# EAGLE schematic Dummy (EAGLE 9.6.2)
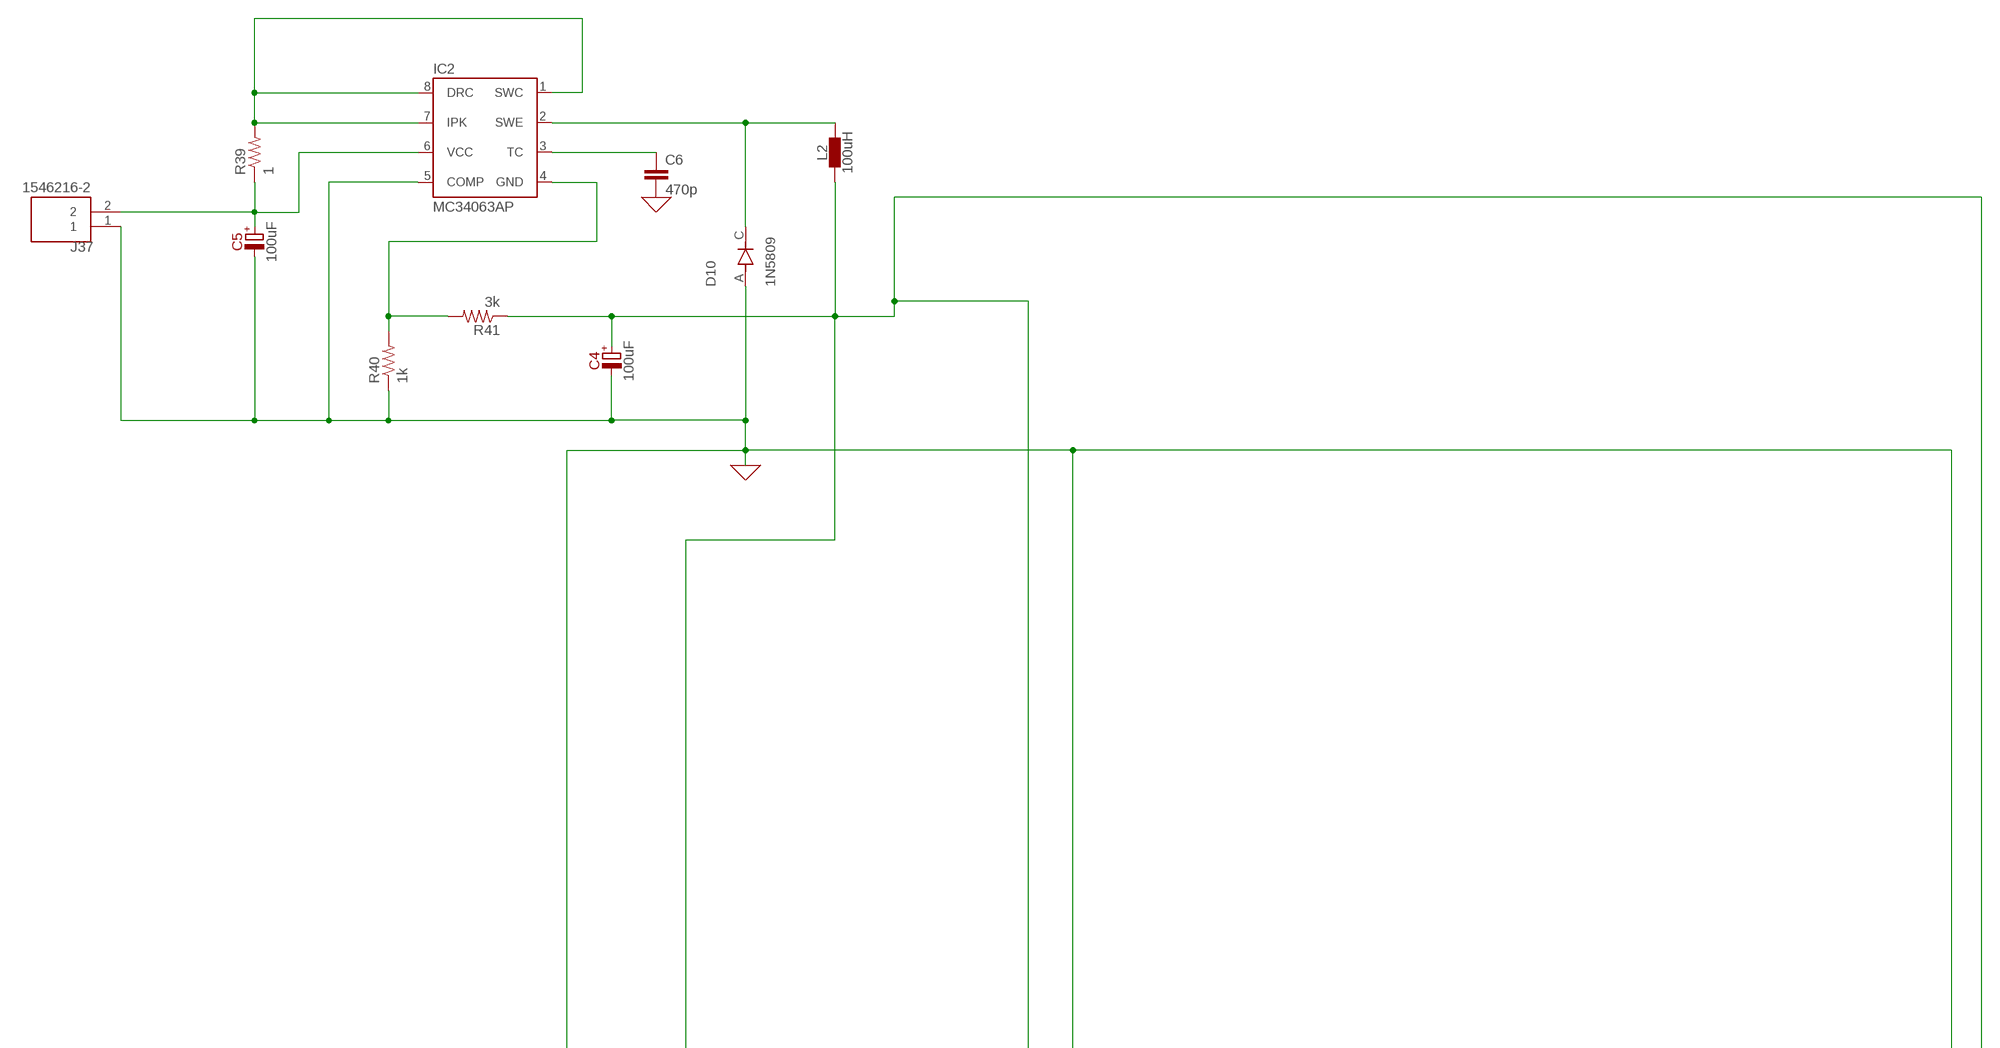
[diagram p0: schematic, sheet 1, part 1 of 3]
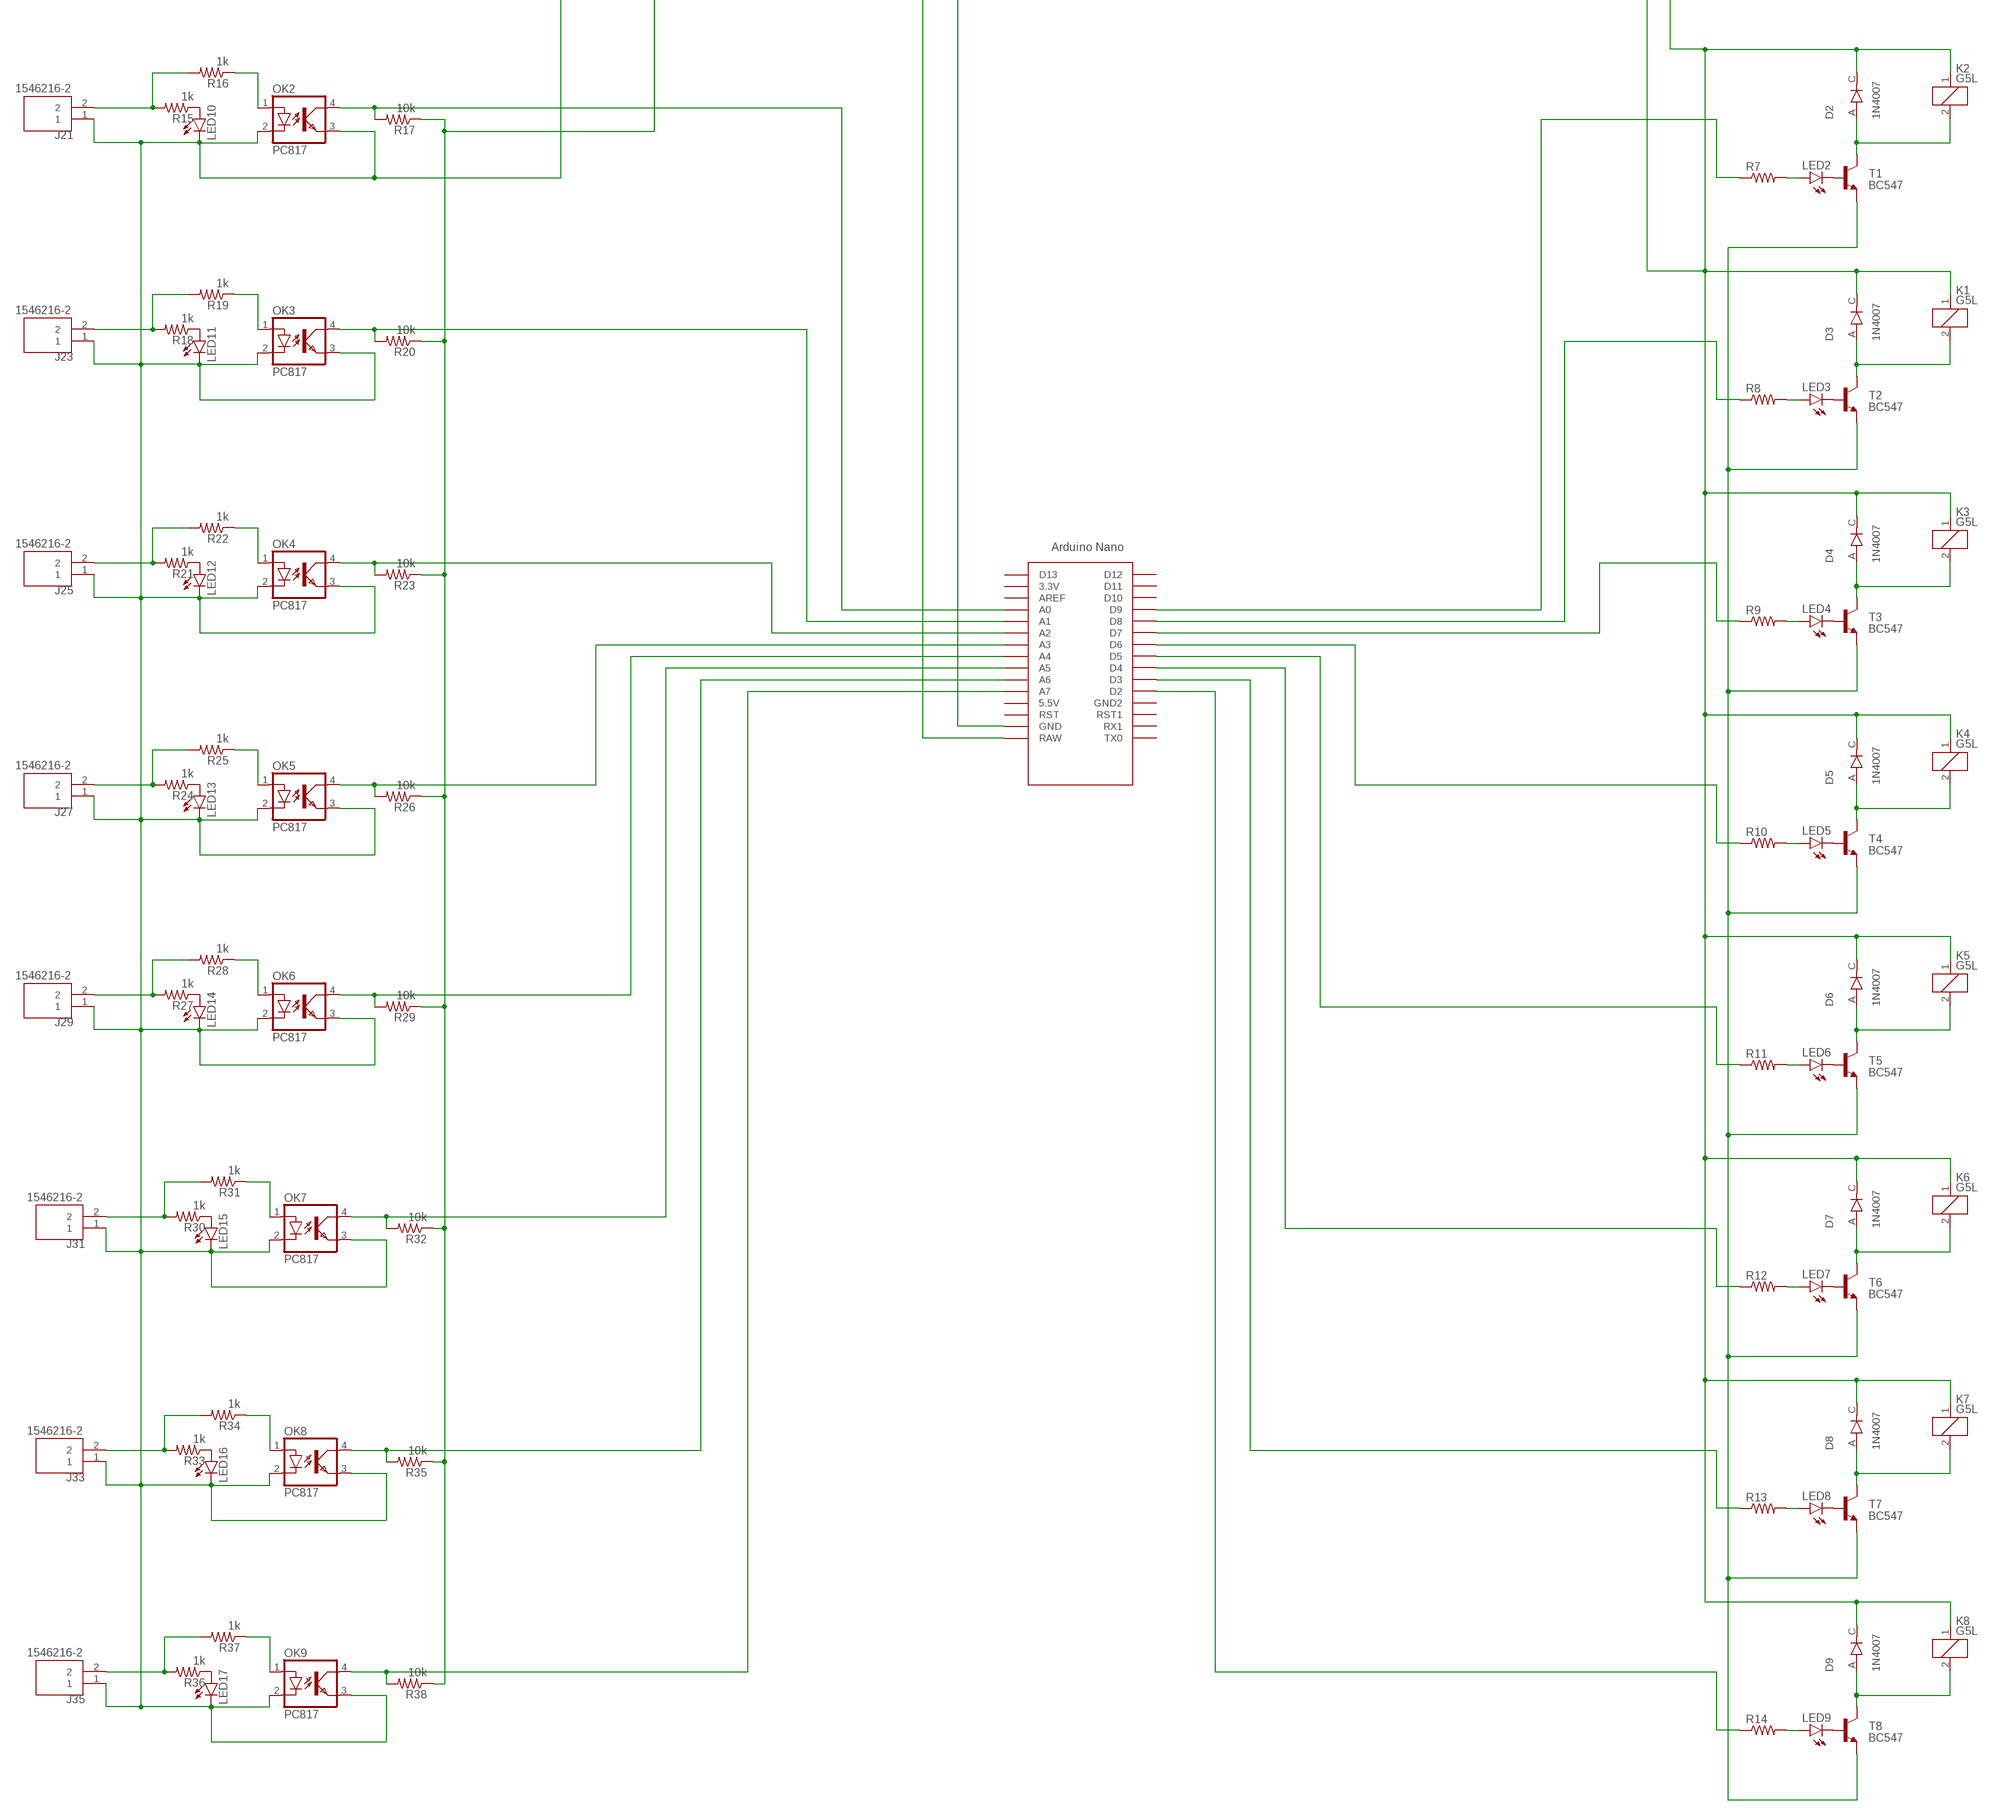
[diagram p1: schematic, sheet 1, part 2 of 3]
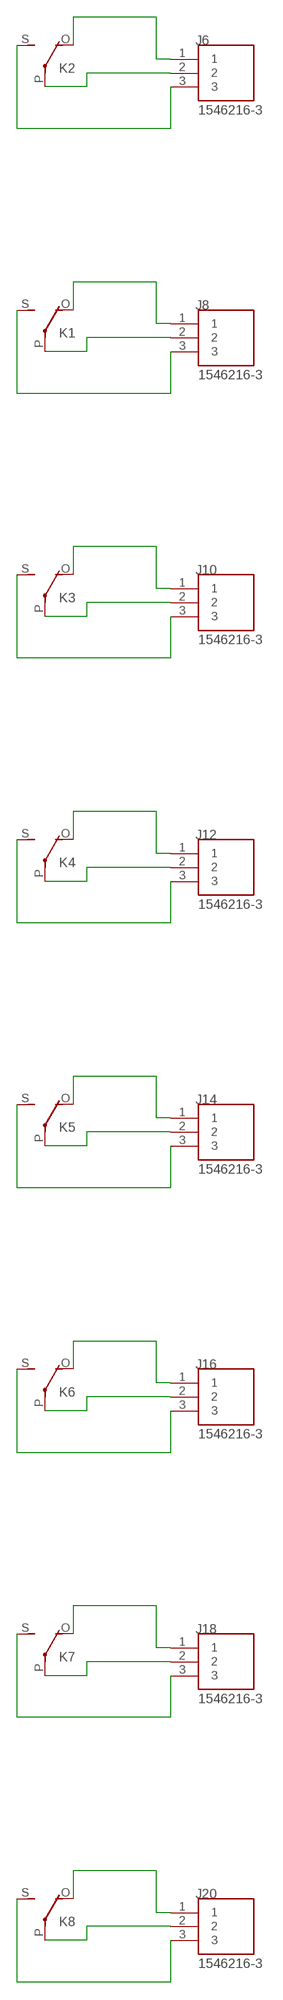
[diagram p2: schematic, sheet 1, part 3 of 3]

## Parts
C4  100uF  1U/50V  [E1,5-4]
C5  100uF  1U/50V  [E1,5-4]
C6  470p  C2.5/2  [C2.5-2]
D2  1N4007  [DIOAD1060W80L520D270]
D3  1N4007  [DIOAD1060W80L520D270]
D4  1N4007  [DIOAD1060W80L520D270]
D5  1N4007  [DIOAD1060W80L520D270]
D6  1N4007  [DIOAD1060W80L520D270]
D7  1N4007  [DIOAD1060W80L520D270]
D8  1N4007  [DIOAD1060W80L520D270]
D9  1N4007  [DIOAD1060W80L520D270]
D10  1N5809  1N4007  [DIOAD1060W80L520D270]
IC2  MC34063AP  [DIL-08]
J6  1546216-3  [TE_1546216-3]
J8  1546216-3  [TE_1546216-3]
J10  1546216-3  [TE_1546216-3]
J12  1546216-3  [TE_1546216-3]
J14  1546216-3  [TE_1546216-3]
J16  1546216-3  [TE_1546216-3]
J18  1546216-3  [TE_1546216-3]
J20  1546216-3  [TE_1546216-3]
J21  1546216-2  [TE_1546216-2]
J23  1546216-2  [TE_1546216-2]
J25  1546216-2  [TE_1546216-2]
J27  1546216-2  [TE_1546216-2]
J29  1546216-2  [TE_1546216-2]
J31  1546216-2  [TE_1546216-2]
J33  1546216-2  [TE_1546216-2]
J35  1546216-2  [TE_1546216-2]
J37  1546216-2  [TE_1546216-2]
K1  G5L  [G5LE]
K2  G5L  [G5LE]
K3  G5L  [G5LE]
K4  G5L  [G5LE]
K5  G5L  [G5LE]
K6  G5L  [G5LE]
K7  G5L  [G5LE]
K8  G5L  [G5LE]
L2  100uH  INDUCTOR-NR80XX  [L_NR80XX]
LED2  LED3MM  [LED3MM]
LED3  LED3MM  [LED3MM]
LED4  LED3MM  [LED3MM]
LED5  LED3MM  [LED3MM]
LED6  LED3MM  [LED3MM]
LED7  LED3MM  [LED3MM]
LED8  LED3MM  [LED3MM]
LED9  LED3MM  [LED3MM]
LED10  LED3MM  [LED3MM]
LED11  LED3MM  [LED3MM]
LED12  LED3MM  [LED3MM]
LED13  LED3MM  [LED3MM]
LED14  LED3MM  [LED3MM]
LED15  LED3MM  [LED3MM]
LED16  LED3MM  [LED3MM]
LED17  LED3MM  [LED3MM]
OK2  PC817  [DIL04]
OK3  PC817  [DIL04]
OK4  PC817  [DIL04]
OK5  PC817  [DIL04]
OK6  PC817  [DIL04]
OK7  PC817  [DIL04]
OK8  PC817  [DIL04]
OK9  PC817  [DIL04]
R7  R-US_0207/15  [0207/15]
R8  R-US_0207/15  [0207/15]
R9  R-US_0207/15  [0207/15]
R10  R-US_0207/15  [0207/15]
R11  R-US_0207/15  [0207/15]
R12  R-US_0207/15  [0207/15]
R13  R-US_0207/15  [0207/15]
R14  R-US_0207/15  [0207/15]
R15  1k  R-US_0207/15  [0207/15]
R16  1k  R-US_0207/15  [0207/15]
R17  10k  R-US_0207/15  [0207/15]
R18  1k  R-US_0207/15  [0207/15]
R19  1k  R-US_0207/15  [0207/15]
R20  10k  R-US_0207/15  [0207/15]
R21  1k  R-US_0207/15  [0207/15]
R22  1k  R-US_0207/15  [0207/15]
R23  10k  R-US_0207/15  [0207/15]
R24  1k  R-US_0207/15  [0207/15]
R25  1k  R-US_0207/15  [0207/15]
R26  10k  R-US_0207/15  [0207/15]
R27  1k  R-US_0207/15  [0207/15]
R28  1k  R-US_0207/15  [0207/15]
R29  10k  R-US_0207/15  [0207/15]
R30  1k  R-US_0207/15  [0207/15]
R31  1k  R-US_0207/15  [0207/15]
R32  10k  R-US_0207/15  [0207/15]
R33  1k  R-US_0207/15  [0207/15]
R34  1k  R-US_0207/15  [0207/15]
R35  10k  R-US_0207/15  [0207/15]
R36  1k  R-US_0207/15  [0207/15]
R37  1k  R-US_0207/15  [0207/15]
R38  10k  R-US_0207/15  [0207/15]
R39  1  R-US_0207/12  [0207/12]
R40  1k  R-US_0207/12  [0207/12]
R41  3k  R-US_0207/12  [0207/12]
T1  BC547  [TO92]
T2  BC547  [TO92]
T3  BC547  [TO92]
T4  BC547  [TO92]
T5  BC547  [TO92]
T6  BC547  [TO92]
T7  BC547  [TO92]
T8  BC547  [TO92]
U$1  NANO  [NANO]

## Nets
0: C4.+ C4.- C5.- C6.2 D2.C D3.C D4.C D5.C D6.C D7.C D8.C D9.C D10.A IC2.5(COMP) J21.1 J23.1 J25.1 J27.1 J29.1 J31.1 J33.1 J35.1 J37.1 K1.1 K2.1 K3.1 K4.1 K5.1 K6.1 K7.1 K8.1 L2.1 LED10.K(C) LED11.K(C) LED12.K(C) LED13.K(C) LED14.K(C) LED15.K(C) LED16.K(C) LED17.K(C) OK2.2(C) OK2.3(EMIT) OK3.2(C) OK3.3(EMIT) OK4.2(C) OK4.3(EMIT) OK5.2(C) OK5.3(EMIT) OK6.2(C) OK6.3(EMIT) OK7.2(C) OK7.3(EMIT) OK8.2(C) OK8.3(EMIT) OK9.2(C) OK9.3(EMIT) R17.1 R20.1 R23.1 R26.1 R29.1 R32.1 R35.1 R38.1 R40.1 R41.1 U$1.GND U$1.RAW ; supply symbol labelled GND
N$13: LED2.K(C) T1.2(B)
N$14: R7.1 U$1.D9
N$15: LED2.A R7.2
N$16: D2.A K2.2 T1.3(C)
N$19: J6.1 K2.O(2:O)
N$20: J6.2 K2.P(2:P)
N$21: J6.3 K2.S(2:S)
N$22: LED3.K(C) T2.2(B)
N$23: R8.1 U$1.D8
N$24: LED3.A R8.2
N$25: D3.A K1.2 T2.3(C)
N$28: J8.1 K1.O(2:O)
N$29: J8.2 K1.P(2:P)
N$30: J8.3 K1.S(2:S)
N$31: LED4.K(C) T3.2(B)
N$32: R9.1 U$1.D7
N$33: LED4.A R9.2
N$34: D4.A K3.2 T3.3(C)
N$37: J10.1 K3.O(2:O)
N$38: J10.2 K3.P(2:P)
N$39: J10.3 K3.S(2:S)
N$40: LED5.K(C) T4.2(B)
N$41: R10.1 U$1.D6
N$42: LED5.A R10.2
N$43: D5.A K4.2 T4.3(C)
N$46: J12.1 K4.O(2:O)
N$47: J12.2 K4.P(2:P)
N$48: J12.3 K4.S(2:S)
N$49: LED6.K(C) T5.2(B)
N$50: R11.1 U$1.D5
N$51: LED6.A R11.2
N$52: D6.A K5.2 T5.3(C)
N$55: J14.1 K5.O(2:O)
N$56: J14.2 K5.P(2:P)
N$57: J14.3 K5.S(2:S)
N$58: LED7.K(C) T6.2(B)
N$59: R12.1 U$1.D4
N$60: LED7.A R12.2
N$61: D7.A K6.2 T6.3(C)
N$64: J16.1 K6.O(2:O)
N$65: J16.2 K6.P(2:P)
N$66: J16.3 K6.S(2:S)
N$67: LED8.K(C) T7.2(B)
N$68: R13.1 U$1.D3
N$69: LED8.A R13.2
N$70: D8.A K7.2 T7.3(C)
N$73: J18.1 K7.O(2:O)
N$74: J18.2 K7.P(2:P)
N$75: J18.3 K7.S(2:S)
N$76: LED9.K(C) T8.2(B)
N$77: R14.1 U$1.D2
N$78: LED9.A R14.2
N$79: D9.A K8.2 T8.3(C)
N$80: T1.1(E) T2.1(E) T3.1(E) T4.1(E) T5.1(E) T6.1(E) T7.1(E) T8.1(E)
N$82: J20.1 K8.O(2:O)
N$83: J20.2 K8.P(2:P)
N$84: J20.3 K8.S(2:S)
N$85: LED10.A R15.1
N$86: J21.2 R15.2 R16.2
N$87: OK2.1(A) R16.1
N$90: OK2.4(COL) R17.2 U$1.A0
N$91: LED11.A R18.1
N$92: J23.2 R18.2 R19.2
N$93: OK3.1(A) R19.1
N$96: OK3.4(COL) R20.2 U$1.A1
N$97: LED12.A R21.1
N$98: J25.2 R21.2 R22.2
N$99: OK4.1(A) R22.1
N$102: OK4.4(COL) R23.2 U$1.A2
N$103: LED13.A R24.1
N$104: J27.2 R24.2 R25.2
N$105: OK5.1(A) R25.1
N$108: OK5.4(COL) R26.2 U$1.A3
N$109: LED14.A R27.1
N$110: J29.2 R27.2 R28.2
N$111: OK6.1(A) R28.1
N$114: OK6.4(COL) R29.2 U$1.A4
N$115: LED15.A R30.1
N$116: J31.2 R30.2 R31.2
N$117: OK7.1(A) R31.1
N$120: OK7.4(COL) R32.2 U$1.A5
N$121: LED16.A R33.1
N$122: J33.2 R33.2 R34.2
N$123: OK8.1(A) R34.1
N$126: OK8.4(COL) R35.2 U$1.A6
N$127: LED17.A R36.1
N$128: J35.2 R36.2 R37.2
N$129: OK9.1(A) R37.1
N$132: OK9.4(COL) R38.2 U$1.A7
N$133: IC2.1(SWC) IC2.7(IPK) IC2.8(DRC) R39.2
N$134: D10.C IC2.2(SWE) L2.2
N$135: C6.1 IC2.3(TC)
N$136: IC2.4(GND) R40.2 R41.2
N$138: C5.+ IC2.6(VCC) J37.2 R39.1
Unconnected: U$1.3.3V U$1.5V(5.5V) U$1.AREF U$1.D10 U$1.D11 U$1.D12 U$1.D13 U$1.GND1(GND2) U$1.ICSP1 U$1.ICSP2 U$1.ICSP3 U$1.ICSP4 U$1.ICSP5 U$1.ICSP6 U$1.RST U$1.RST1 U$1.RX1 U$1.TX0

## Library data of the parts
C4 C5 = capacitors-electrolytic:?; MOUSER: 647-USW1H010MDD
C6 = capacitor-wima:C: CAPACITOR naming: grid - package width
D2-D10 = 1N4007:1N4007: Diode Switching 1KV 1A 2-Pin DO-41 Check availability <https://pricing.snapeda.com/parts/1N4007/ON%20Semiconductor/view-part?ref=eda>; AVAILABILITY: In Stock; DESCRIPTION: Diode Standard 1000V 1A Through Hole DO-204AL (DO-41); MF: ON Semiconductor; MP: 1N4007; PACKAGE: DO-41-2 ON Semiconductor; PRICE: None; PURCHASE-URL: https://pricing.snapeda.com/search/part/1N4007/?ref=eda
IC2 = MC34063A:MC34063A: 1.5A Step-Up/Down/Inverting Switching Regulator NPN Darlington Switch, Vin 3V to 40V, Current Limiter Input, adjustable Frequency up to 100kHz Check availability <https://pricing.snapeda.com/parts/MC34063A/Texas%20Instruments/view-part?ref=eda>; AVAILABILITY: In Stock; DESCRIPTION: Buck, Boost Switching Regulator IC Positive or Negative Adjustable 1.25V 1 Output 1.5A (Switch) 8-SOIC (0.154, 3.90mm Width); MF: Texas Instruments; MP: MC34063A; PACKAGE: SOIC-8 Texas Instruments; PRICE: None; PURCHASE-URL: https://pricing.snapeda.com/search/part/MC34063A/?ref=eda
J6 J8 J10 J12 J14 J16 J18 J20 = terminal-block-3p:1546216-3: Check availability <https://pricing.snapeda.com/parts/1546216-3/TE%20Connectivity/view-part?ref=eda>; AVAILABILITY: In Stock; COMMENT: 1546216-3; DESCRIPTION: 3 Position Wire to Board Terminal Block Horizontal with Board 0.197 (5.00mm) Through Hole; MF: TE Connectivity; MP: 1546216-3; PACKAGE: None; PRICE: None; PURCHASE-URL: https://pricing.snapeda.com/search/part/1546216-3/?ref=eda
J21 J23 J25 J27 J29 J31 J33 J35 J37 = terminal-block-2p:1546216-2: Check availability <https://pricing.snapeda.com/parts/1546216-2/TE%20Connectivity/view-part?ref=eda>; AVAILABILITY: In Stock; CENTERLINE_PITCH: 5 mm[.197 in]; COMMENT: 1546216-2; DESCRIPTION: TERMI-BLOK PCB MOUNT 90 2P.; EU_ROHS_COMPLIANCE: Compliant with Exemptions; MF: TE Connectivity; MP: 1546216-2; NUMBER_OF_POSITIONS: 2; PACKAGE: None; PRICE: None; PURCHASE-URL: https://pricing.snapeda.com/search/part/1546216-2/?ref=eda
K1-K8 = relay:G5L: RELAY 1 x switch, 10 A/120 V AC, 8 A/30 V ADC, Omron; OC_FARNELL: unknown; OC_NEWARK: unknown
L2 = we-power:INDUCTOR: Power Inductor Taiyo Yuden NRxxxx are compatible with FerroCore DJNRxxxx and YJYCOIN YNRxxxx. 4x4mm - Taiyo Yuden NR4018 / DJNR4018 / YNR4018 NR4018T1R0N - 1.0uH, Ir=4.0A NR4018T2R2N - 2.2uH, Ir=2.7A NR4018T3R3N - 3.3uH, Ir=2.0A NR4018T4R5N - 4.7uH, Ir=1.7A NR4018T6R8N - 6.8uH, Ir=1.4A NR4018T100M - 10uH, Ir=1.2A NR4018T150M - 15uH, Ir=0.94A NR4018T220M - 22uH, Ir=0.80A NR4018T330M - 33uH, Ir=0.65A NR4018T470M - 47uH, Ir=0.57A NR4018T680M - 68uH, Ir=0.47A NR4018T101M - 100uH, Ir=0.40A 6x6mm - Taiyo Yuden NR6028 / DJNR6028 / YNR6028 NR6028T0R9N - 0.9uH, Ir=6.6A NR6028T1R5N - 1.5uH, Ir=5.0A NR6028T2R2N - 2.2uH, Ir=4.2A NR6028T3R0N - 3.0uH, Ir=3.6A NR6028T4R7M - 4.7uH, Ir=2.7A NR6028T6R0M - 6.0uH, Ir=2.5A NR6028T100M - 10uH, Ir=1.9A NR6028T150M - 15uH, Ir=1.6A NR6028T220M - 22uH, Ir=1.3A NR6028T330M - 33uH, Ir=1.1A NR6028T470M - 47uH, Ir=0.95A NR6028T680M - 68uH, Ir=0.76A NR6028T101M - 100uH, Ir=0.62A 6x6mm - Taiyo Yuden NR6045 / DJNR6045 / YNR6045 NR6045T1R0N - 1.0uH, Ir=8.5A NR6045T1R3N - 1.3uH, Ir=8.0A NR6045T1R8N - 1.8uH, Ir=7.0A NR6045T2R3N - 2.3uH, Ir=6.0A NR6045T3R0N - 3.0uH, Ir=5.0A NR6045T4R5M - 4.5uH, Ir=4.0A NR6045T6R3M - 6.3uH, Ir=3.8A NR6045T100M - 10uH, Ir=3.0A NR6045T150M - 15uH, Ir=2.3A NR6045T220M - 22uH, Ir=1.9A NR6045T330M - 33uH, Ir=1.5A NR6045T470M - 47uH, Ir=1.3A NR6045T680M - 68uH, Ir=1.0A NR6045T101M - 100uH, Ir=0.8A 8x8mm - Taiyo Yuden NR8040 / DJNR8040 / YNR8040
LED2-LED17 = led:LED: LED OSRAM: - CHIPLED LG R971, LG N971, LY N971, LG Q971, LY Q971, LO R971, LY R971 LH N974, LH R974 LS Q976, LO Q976, LY Q976 LO Q996 - Hyper CHIPLED LW Q18S LB Q993, LB Q99A, LB R99A - SideLED LS A670, LO A670, LY A670, LG A670, LP A670 LB A673, LV A673, LT A673, LW A673 LH A674 LY A675 LS A676, LA A676, LO A676, LY A676, LW A676 LS A679, LY A679, LG A679 - Hyper Micro SIDELED® LS Y876, LA Y876, LO Y876, LY Y876 LT Y87S - SmartLED LW L88C, LW L88S LB L89C, LB L89S, LG L890 LS L89K, LO L89K, LY L89K LS L896, LA L896, LO L896, LY L896 - TOPLED LS T670, LO T670, LY T670, LG T670, LP T670 LSG T670, LSP T670, LSY T670, LOP T670, LYG T670 LG T671, LOG T671, LSG T671 LB T673, LV T673, LT T673, LW T673 LH T674 LS T676, LA T676, LO T676, LY T676, LB T676, LH T676, LSB T676, LW T676 LB T67C, LV T67C, LT T67C, LS T67K, LO T67K, LY T67K, LW E67C LS E67B, LA E67B, LO E67B, LY E67B, LB E67C, LV E67C, LT E67C LW T67C LS T679, LY T679, LG T679 LS T770, LO T770, LY T770, LG T770, LP T770 LB T773, LV T773, LT T773, LW T773 LH T774 LS E675, LA E675, LY E675, LS T675 LS T776, LA T776, LO T776, LY T776, LB T776 LHGB T686 LT T68C, LB T68C - Hyper Mini TOPLED® LB M676 - Mini TOPLED Santana® LG M470 LS M47K, LO M47K, LY M47K Source: http://www.osram.convergy.de LUXEON: - LUMILED® LXK2-PW12-R00, LXK2-PW12-S00, LXK2-PW14-U00, LXK2-PW14-V00 LXK2-PM12-R00, LXK2-PM12-S00, LXK2-PM14-U00 LXK2-PE12-Q00, LXK2-PE12-R00, LXK2-PE12-S00, LXK2-PE14-T00, LXK2-PE14-U00 LXK2-PB12-K00, LXK2-PB12-L00, LXK2-PB12-M00, LXK2-PB14-N00, LXK2-PB14-P00, LXK2-PB14-Q00 LXK2-PR12-L00, LXK2-PR12-M00, LXK2-PR14-Q00, LXK2-PR14-R00 LXK2-PD12-Q00, LXK2-PD12-R00, LXK2-PD12-S00 LXK2-PH12-R00, LXK2-PH12-S00 LXK2-PL12-P00, LXK2-PL12-Q00, LXK2-PL12-R00 Source: www.luxeon.com KINGBRIGHT: KA-3528ASYC Source: www.kingbright.com
OK2-OK9 = optocoupler:PC817: SHARP OPTO COUPLER; MPN: PC817X4J000F; OC_FARNELL: 9707727; OC_NEWARK: 97K7059
R7-R14 R39-R41 = resistor:R-US_: RESISTOR, American symbol
R15-R38 = rcl:R-US_: RESISTOR, American symbol; SPICEPREFIX: R
T1-T8 = BC547:BC547: NPN TRANSISTOR Check availability <https://pricing.snapeda.com/parts/BC547/ON/view-part?ref=eda>; AVAILABILITY: In Stock; DESCRIPTION: Bipolar (BJT) Transistor NPN 45 V 100 mA 300MHz 625 mW Through Hole TO-92 (TO-226); MF: ON; MP: BC547; PACKAGE: E-PKG AXIAL-LEADED-2 ON Semiconductor; PRICE: None; PURCHASE-URL: https://pricing.snapeda.com/search/part/BC547/?ref=eda
U$1 = Arduino-clone:NANO: Arduino Nano